# Altium schematic sheet main_board.SchDoc
size A4; SheetNumber: 1; SheetTotal: 1
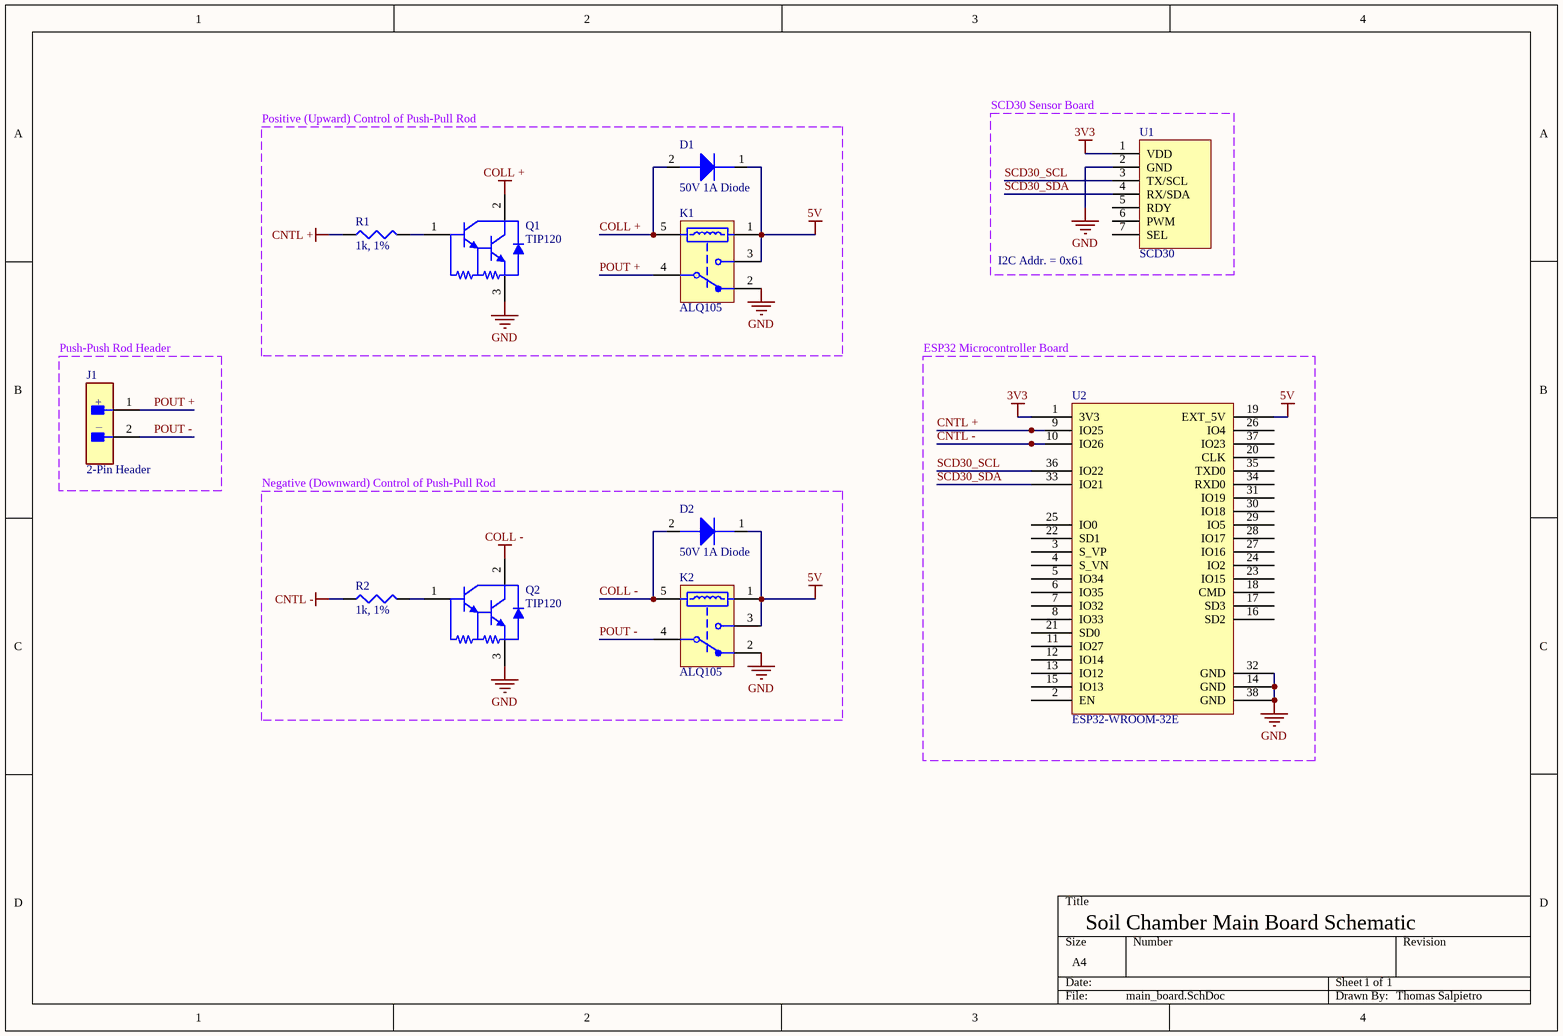
[diagram p0: main_board.SchDoc]

## Parts
D1  50V 1A Diode  [S1A]
D2  50V 1A Diode  [S1A]
J1  2-Pin Header  [HDR2x1]
K1  ALQ105  [ALQ105]
K2  ALQ105  [ALQ105]
Q1  TIP120  [TIP120G]
Q2  TIP120  [TIP120G]
R1  1k, 1%  [1206-1k]
R2  1k, 1%  [1206-1k]
U1  SCD30  [SCD30]
U2  ESP32-WROOM-32E  [ESP32]

## Blocks framed on the sheet
Positive (Upward) Control of Push-Pull Rod: D1 K1 Q1 R1
Push-Push Rod Header: J1
ESP32 Microcontroller Board: U2
Negative (Downward) Control of Push-Pull Rod: D2 K2 Q2 R2

## Nets
3V3: U1.1(VDD) U2.1(3V3)
5V: D1.1 D2.1 K1.1 K1.3(NO) K2.1 K2.3(NO) U2.19(EXT_5V)
CNTL +: R1.1 U2.9(IO25)
CNTL -: R2.1 U2.10(IO26)
COLL +: D1.2 K1.5 Q1.2(C)
COLL -: D2.2 K2.5 Q2.2(C)
GND: K1.2(NC) K2.2(NC) Q1.3(E) Q2.3(E) U1.2(GND) U2.14(GND) U2.32(GND) U2.38(GND)
POUT +: J1.1 K1.4(COM)
POUT -: J1.2 K2.4(COM)
SCD30_SCL: U1.3(TX/SCL) U2.36(IO22)
SCD30_SDA: U1.4(RX/SDA) U2.33(IO21)
NetQ1_1: Q1.1(B) R1.2
NetQ2_1: Q2.1(B) R2.2

Not connected (* = marked no-connect by the designer): U1 5(RDY) 6(PWM) 7(SEL); U2 2(EN) 3(S_VP) 4(S_VN) 5(IO34) 6(IO35) 7(IO32) 8(IO33) 11(IO27) 12(IO14) 13(IO12) 15(IO13) 16(SD2) 17(SD3) 18(CMD) 20(CLK) 21(SD0) 22(SD1) 23(IO15) 24(IO2) 25(IO0) 26(IO4) 27(IO16) 28(IO17) 29(IO5) 30(IO18) 31(IO19) 34(RXD0) 35(TXD0) 37(IO23)

## Notes on the sheet
- SCD30 Sensor Board
- (near U1) I2C Addr. = 0x61
- Soil Chamber Main Board Schematic
- 1
- Thomas Salpietro
- (in symbol 3bc925449376181038e59eaffc5286c) +; _

## Library data of the parts
D1 D2 = S1A: Diode Gen Purp 50V 1A Sma; Manufacturer: Sangdest Microelectronics; Supplier 1: Digi-Key; Manufacturer Part Number: S1A; RoHS: No; Category: Uncategorized; Stock 1: 69965; Pricing 1: 1=0.13, 10=0.118, 100=0.0643, 500=0.03956, 1000=0.02697, 2000=0.02292 (USD); Supplier Part Number 1: 1655-S1ADKR-ND
J1 = 3bc925449376181038e59eaffc5286c: CONN HEADER VERT 2POS 2.54MM; Number of Contacts: 2; Gender: Male; Current Rating: 3A; Voltage Rating: 250V; Insulation Resistance: 1GR; Contact Material: Copper Alloy; Package Quantity: 1000; Color: Beige; Mount: Through Hole; Termination: Through Hole; Fastening Type: Friction; Contact Mating Length: 0.295inch; Pitch: 2.54mm; Max Operating Temperature: 105°C; Height: 14.2mm; RoHS Compliant: Yes; Packaging: Bulk; Contact Type: Male Pin; Width: 5.12mm; Housing Material: Nylon; Min Operating Temperature: -40°C; Insulation Material: Nylon; Contact Finish - Mating: TIN; Insulation Color: Beige; Contact Plating: Tin; Flammability Rating: UL94 V-0; Length: 5.8mm; Contact Gender: Male; Connector Type: Header; Contact Shape: Square; Series: WR-WTB; Number of Positions: 2; Number of Rows: 1
K1 K2 = PNSC-ALQ105-LQ-5-2000x1000x1600-5: LQ Relays, 5 V Coil Voltage, 400 mW Nominal Operating Power, -40 to 85 degC, 5-Pin LQ, Carton, Case, RoHS; Manufacturer: Panasonic; Coil Voltage: 5 V; Max Switching Voltage: 250 V AC; Mechanical Life(Min.operation): 1x10^7; Electrical Life: 5x10^4; Pb-Free: True; Nominal Operating Power: 400 mW; Max Switching Current: 10 A (N.O.), 3 A (N.C.); RoHS: True; PackageReference: LQ-5-2000x1000x1600; Packing: Carton, Case; PackageDescription: 5-Pin Through Hole Terminal Package, Body 20 x 10 mm; ComponentLink1Description: Manufacturer URL; ComponentLink3Description: Package Specification; DatasheetVersion: 201410-T; ComponentLink1URL: http://www3.panasonic.biz/ac/ae/index.jsp; ComponentLink3URL: http://www3.panasonic.biz/ac/e_download/control/relay/power/catalog/mech_eng_lq.pdf?f_cd=401220; PartNumber: ALQ105; Mounting Technology: Through Hole; ComponentLink2Description: Datasheet; Series: LQ Relays; ComponentLink2URL: http://www3.panasonic.biz/ac/e_download/control/relay/power/catalog/mech_eng_lq.pdf?f_cd=401220; PackageVersion: ASCTB92E, 10/2014
Q1 Q2 = TIP120G: ON Semi TIP120G NPN Darlington Transistor 8 A 60 V HFE: 1000 3-Pin TO-220; Manufacturer: ON Semiconductor; Max Power Dissipation: 65W; Collector Emitter Voltage (VCEO): 60V; Emitter Base Voltage (VEBO): 5V; Max Collector Current: 5A; Collector Emitter Saturation Voltage: 4V; hFE Min: 1000; Number of Elements: 1; Supplier 1: Digi-Key; Manufacturer Part Number: TIP120G; RoHS: Yes; Category: BJTs; Pricing 1: 1=0.76, 10=0.67, 100=0.5138, 500=0.40612, 1000=0.3249, 2000=0.29444, 5000=0.27413, 10000=0.26398 (USD); Case/Package: TO-220-3; Number of Pins: 3; Min Operating Temperature: -65°C; Max Operating Temperature: 150°C; Package Quantity: 50; Packaging: Rail/Tube; Polarity: NPN; Series: -; Collector Base Voltage (VCBO): 60V; Power Dissipation: 65W; Collector Emitter Breakdown Voltage: 60V; Collector-emitter Voltage-Max: 4V; Voltage Rating (DC): 60V; Current Rating: 5A; Continuous Collector Current: 5A; Length: 0.404inch; Width: 0.19inch; Height: 0.62inch; Radiation Hardening: No; Lead Free: Lead Free; RoHS Compliant: Yes; Reach SVHC Compliant: No; ComponentLink1URL: https://datasheet.ciiva.com/19476/803671-19476952.pdf?src-supplier=Jameco; ComponentLink1Description: https://datasheet.ciiva.com/19476/803671-19476952.pdf?src-supplier=Jameco; ComponentLink2URL: https://datasheet.ciiva.com/15139/getdatasheetpartid-41389-15139855.pdf?src-supplier=Verical; ComponentLink2Description: https://datasheet.ciiva.com/15139/getdatasheetpartid-41389-15139855.pdf?src-supplier=Verical; ComponentLink3URL: https://datasheet.ciiva.com/14546/70099572-14546719.pdf?src-supplier=Allied+Electronics; ComponentLink3Description: https://datasheet.ciiva.com/14546/70099572-14546719.pdf?src-supplier=Allied+Electronics; ComponentLink4URL: https://datasheet.ciiva.com/11210/tip120-d-11210463.pdf?src-supplier=Avnet; ComponentLink4Description: https://datasheet.ciiva.com/11210/tip120-d-11210463.pdf?src-supplier=Avnet; ComponentLink5URL: https://datasheet.ciiva.com/977/tip120-d-977163.pdf?src-supplier=Digi-Key; ComponentLink5Description: https://datasheet.ciiva.com/977/tip120-d-977163.pdf?src-supplier=Digi-Key; Supplier Part Number 1: TIP120GOS-ND
R1 R2 = 3503G2B1K0FTDF: Res 1K Ohm 1% 2W 1206; Manufacturer: TE Connectivity; Supplier 1: Digi-Key; Manufacturer Part Number: 3503G2B1K0FTDF; RoHS: No; Category: Chip SMD Resistors; Pricing 1: 1000=0.6642 (USD); RoHS Compliant: No; Supplier Part Number 1: 1712-3503G2B1K0FTDFTR-ND
U1 = SCD30: SCD30 Series 5.5 V 75 mA ±3% Carbon Dioxide (CO2) Sensor Module; Manufacturer: Sensirion; Operating Supply Current: 75mA; Supplier 1: Digi-Key; Manufacturer Part Number: SCD30; RoHS: Yes; Category: Sensors; Stock 1: 21624; Pricing 1: 1=61.79, 10=52.035, 25=48.7832, 80=47.15688 (USD); Min Operating Temperature: 0°C; Max Operating Temperature: 50°C; Series: -; Accuracy: 3%; RoHS Compliant: Yes; ComponentLink1URL: http://www.farnell.com/datasheets/2817986.pdf?src-supplier=Farnell; ComponentLink1Description: http://www.farnell.com/datasheets/2817986.pdf?src-supplier=Farnell; ComponentLink2URL: https://www.sensirion.com/fileadmin/user_upload/customers/sensirion/Dokumente/9.5_CO2/Sensirion_CO2_Sensors_Chart_Overview.pdf?src-supplier=Digi-Key; ComponentLink2Description: https://www.sensirion.com/fileadmin/user_upload/customers/sensirion/Dokumente/9.5_CO2/Sensirion_CO2_Sensors_Chart_Overview.pdf?src-supplier=Digi-Key; ComponentLink3URL: http://www.farnell.com/datasheets/2817986.pdf?src-supplier=Newark; ComponentLink3Description: http://www.farnell.com/datasheets/2817986.pdf?src-supplier=Newark; Supplier Part Number 1: 1649-1098-ND
U2 = ESP32-DEVKITC-32E: ESP32-WROOM-32E 4MB Flash; Manufacturer: Espressif Systems; Supplier 1: Digi-Key; Manufacturer Part Number: ESP32-DEVKITC-32E; RoHS: No; Category: RF Semiconductors and Devices; Stock 1: 1044; Pricing 1: 1=10 (USD); Supplier Part Number 1: 1965-ESP32-DEVKITC-32E-ND